# Altium schematic sheet BGA LEDs C.SchDoc: Schematic Sheet Test Title
size 289 x 193 mm; Organization: CXQ; Address1: RM 7401, 550 Jumen Rd, Huangpu District, Shanghai, China; Address2: Huangpu District; Address3: Shanghai; Address4: China; Revision: MB0004-01.A.1; SheetNumber: 1; SheetTotal: 99; PageSetup: Record=PageOptions|CenterHorizontal=True|CenterVertical=True|PrintScale=0.98|XCorrection=1.00|YCorrection=1.00|PrintKind=0|BorderSize=5000000|LeftOffset=0|BottomOffset=0|Orientation=2|PaperLength=1000|PaperWidth=1000|Scale=100|PaperSource=7|PrintQuality=-4|MediaType=1|DitherType=10|PaperKind=A4|PrintScaleMode=1; ProjectName: Project Name
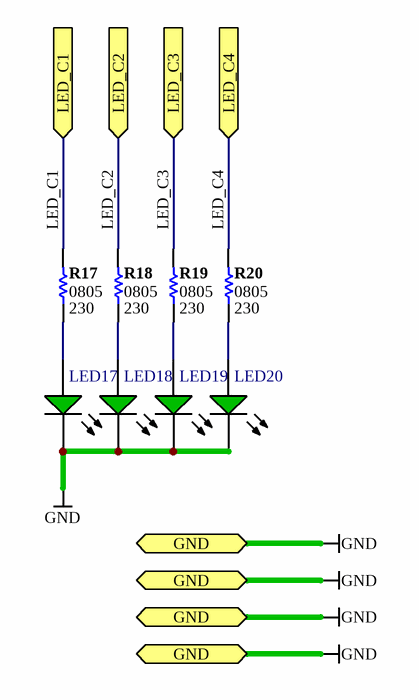
[diagram p0: BGA LEDs C.SchDoc]

## Parts
LED17  LED_1206  [RESC0805(2012)70_L]  (value not drawn)
LED18  LED_1206  [RESC0805(2012)70_L]  (value not drawn)
LED19  LED_1206  [RESC0805(2012)70_L]  (value not drawn)
LED20  LED_1206  [RESC0805(2012)70_L]  (value not drawn)
R17  0805  Value (Ohms): 230  [RESC0805(2012)70_L]
R18  0805  Value (Ohms): 230  [RESC0805(2012)70_L]
R19  0805  Value (Ohms): 230  [RESC0805(2012)70_L]
R20  0805  Value (Ohms): 230  [RESC0805(2012)70_L]

## Ports
GND, LED_C1 (in), LED_C2 (in), LED_C3 (in), LED_C4 (in)

## Nets
GND: LED17.2(K) LED18.2(K) LED19.2(K) LED20.2(K) ; port GND
LED_C1: R17.2 ; port LED_C1
LED_C2: R18.2 ; port LED_C2
LED_C3: R19.2 ; port LED_C3
LED_C4: R20.2 ; port LED_C4
NetLED17_1: LED17.1(A) R17.1
NetLED18_1: LED18.1(A) R18.1
NetLED19_1: LED19.1(A) R19.1
NetLED20_1: LED20.1(A) R20.1

## Notes on the sheet
- A4
- DOCUMENT
- DATE
- TIME
- of
- SHEET
- ADDR
- FILE
- RM 7401, 550 Jumen Road
- Huangpu District, Shanghai, China
- www.mesheven.com

## Library data of the parts
LED17-LED20 = CMP-0201-0036: GREEN color, 1206, SMD; Manufacturer_PN: 1206-LED-GREEN; DefaultDesignator: LED?; Class: Diodes; Sub Class: LED; ID: CMP-0201-0036; Reverse Voltage DC (Vr): Green; ComponentLink1Description: Datasheet; ComponentLink2Description: Manufacturer
R17-R20 = CMP-0501-0000: Jumper 0805 (2012 Metric); Value: 0R; Case-Metric: 2012; Temp Coefficient ppm/°C: None; ID: CMP-0501-0000; Case-EIA: 0805; Tolerance %: None; Power: None; Technology: SMT